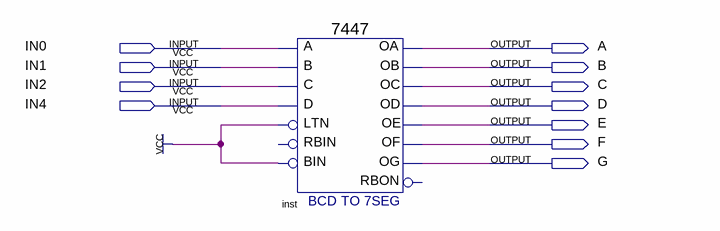
[diagram p0: schematic sheet]
// Quartus schematic Conversor.bdf as structural Verilog: 1 symbols, 11 pins
module Conversor (
  input  IN0,
  input  IN1,
  input  IN2,
  input  IN4,
  output A,
  output B,
  output C,
  output D,
  output E,
  output F,
  output G
);

  \7447  inst (
    .LTN(1'b1), .B(IN1), .C(IN2), .D(IN4), .BIN(1'b1), .A(IN0), .OB(B), .OC(C), .OE(E), .OD(D), .OF(F),
    .OG(G), .OA(A));  // open: RBIN, RBON
endmodule
